# EAGLE design voltage_doubler (EAGLE 7.5.0)
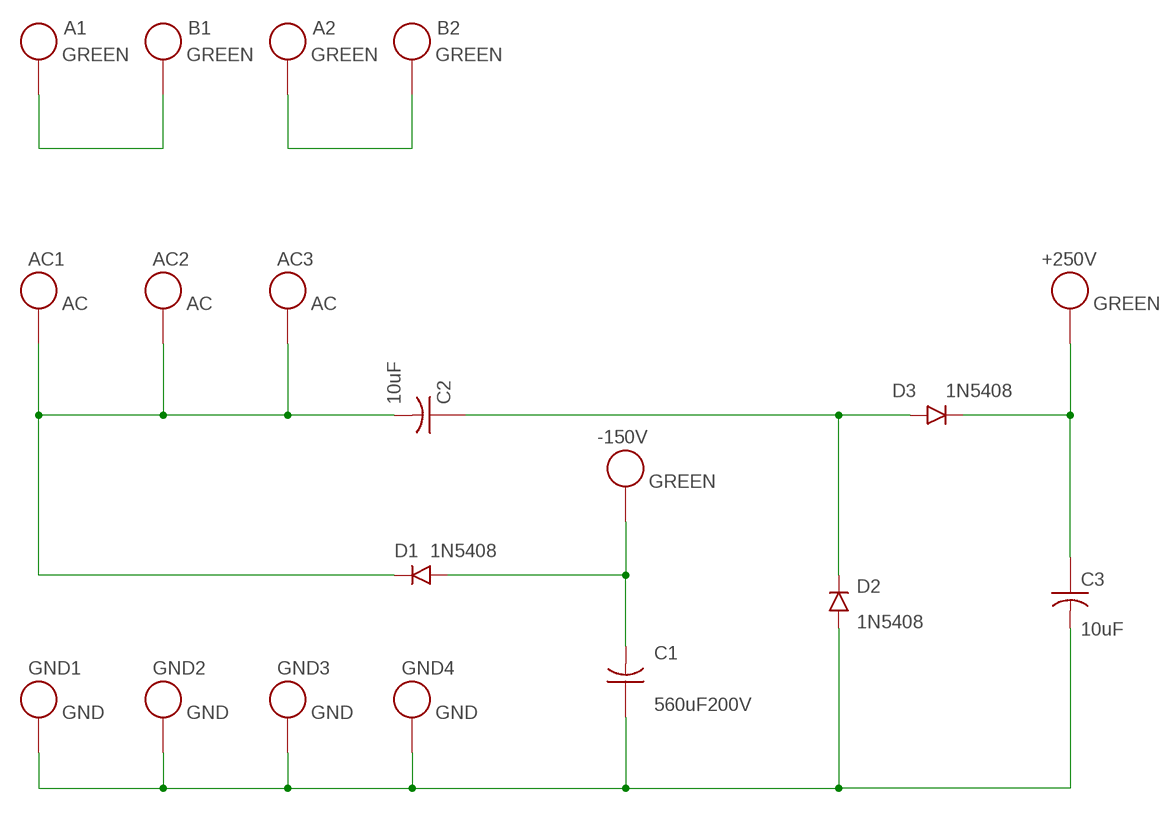
[diagram p0: schematic, sheet 1]

## Parts
+250V  GREEN  BANANA_JACK_GREEN  [AWG22]
-150V  GREEN  BANANA_JACK_GREEN  [AWG22]
A1  GREEN  BANANA_JACK_GREEN  [AWG22]
A2  GREEN  BANANA_JACK_GREEN  [AWG22]
AC1  AC  BANANA_JACK_GREEN  [AWG22]
AC2  AC  BANANA_JACK_GREEN  [AWG22]
AC3  AC  BANANA_JACK_GREEN  [AWG22]
B1  GREEN  BANANA_JACK_GREEN  [AWG22]
B2  GREEN  BANANA_JACK_GREEN  [AWG22]
C1  560uF200V  WIREDCAP  [WIREDCAP]
C2  10uF  CAP400V10UF  [AXIAL10UF400V]
C3  10uF  CAP400V10UF  [AXIAL10UF400V]
D1  1N5408  [DO-201AD]
D2  1N5408  [DO-201AD]
D3  1N5408  [DO-201AD]
GND1  GND  BANANA_JACK_GREEN  [AWG22]
GND2  GND  BANANA_JACK_GREEN  [AWG22]
GND3  GND  BANANA_JACK_GREEN  [AWG22]
GND4  GND  BANANA_JACK_GREEN  [AWG22]

## Nets
N$1: -150V.P$1 C1.P$2 D1.A
N$2: AC1.P$1 AC2.P$1 AC3.P$1 C2.P$2 D1.C
N$3: C1.P$1 C3.P$2 D2.A GND1.P$1 GND2.P$1 GND3.P$1 GND4.P$1
N$4: C2.P$1 D2.C D3.A
N$5: +250V.P$1 C3.P$1 D3.C
N$6: A2.P$1 B2.P$1
N$7: A1.P$1 B1.P$1

## Library data of the parts
+250V -150V A1 A2 B1 B2 = keiths:BANANA_JACK_GREEN: Banana Jack Green, Solder Tab; MPN: 108-0904-001
AC1-AC3 GND1-GND4 = keiths:BANANA_JACK_GREEN: Banana Jack Green, Solder Tab; MPN: 108-0904-001; VALUE: GREEN
C1 = keiths:WIREDCAP: A soldier pad.
C2 C3 = keiths:CAP400V10UF: ALUMINUM ELECTROLYTIC CAPACITOR 400volts 10uF 13x26 20%
D1-D3 = keiths:1N5408: 1N5408 Rectifier Diode 3A 1000V

## Board
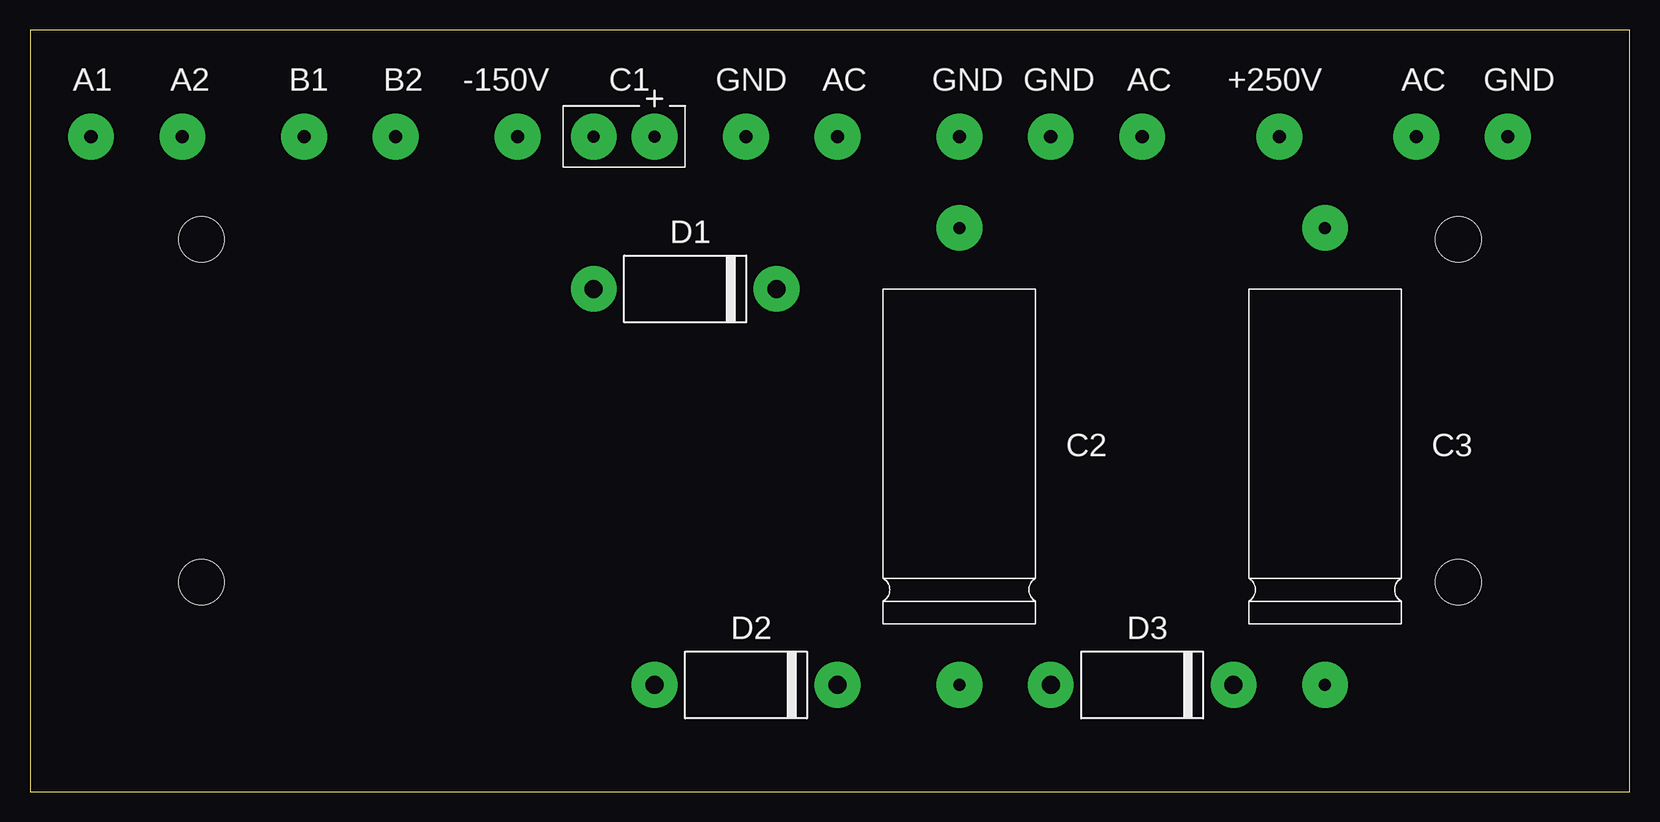
[diagram p1: board, top side]
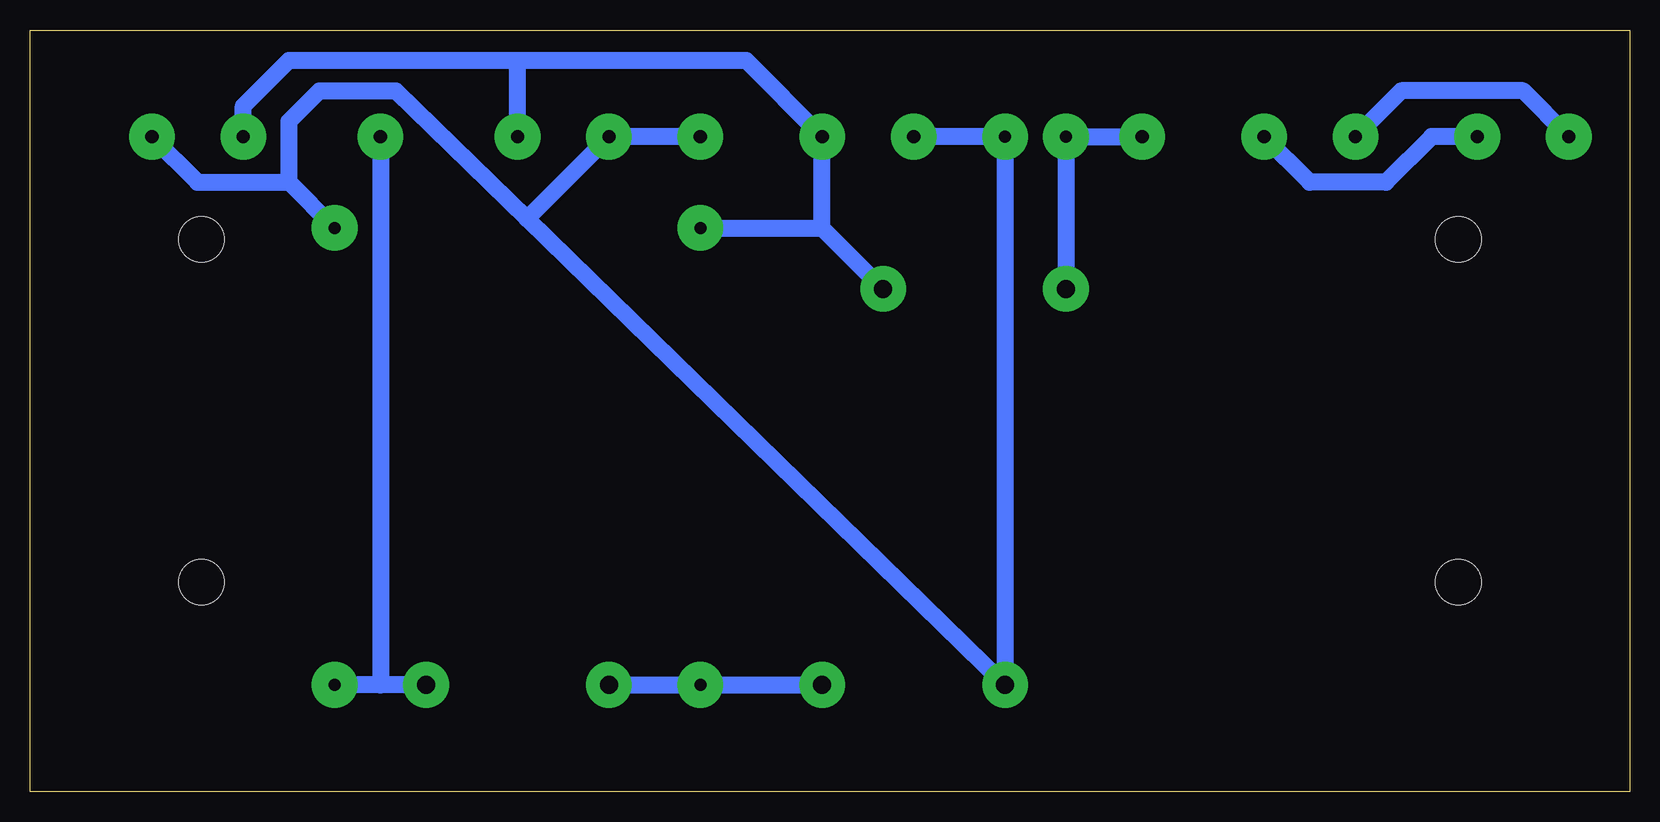
[diagram p2: board, bottom side, seen from below]

Size 133.35 x 63.5 mm. Coordinates in mm from the lower left corner, seen from the top.
Outline: 0,0 133.35,0 133.35,63.5 0,63.5 0,0
Copper layers (1*16): Top 0.035mm / dielectric 1.5mm / Bottom 0.035mm
Design rules "default": minimum track width 10mil, minimum drill 24mil, track to track 8mil, track to pad 8mil, pad to pad 8mil, via to via 8mil, smd to smd 8mil, copper to edge 40mil, drill to drill 8mil, minimum pad ring 10mil, minimum via ring 8mil, stop-mask expansion 4mil, vias tented up to drill 0mil, thermal gap 10mil
Holes 3.8 mm at 14.29,17.46 14.29,46.04 119.06,17.46 119.06,46.04

### Footprints (pad centres in the part's own frame; a part is rotated, then mirrored left to right if it is on the bottom)
AWG22 = drill 1.1 pad 3.81: P$1 0,0
WIREDCAP = drill 1 pad 3.81: P$1 2.54,0; P$2 -2.54,0
AXIAL10UF400V = drill 1 pad 3.81: P$1 19.05,0; P$2 -19.05,0
DO-201AD = drill 1.499 pad 3.81: A 7.62,0; C -7.62,0

### Placement (x,y rotation side)
+250V  104.14,54.61 0 top
-150V  40.64,54.61 0 top
A1  5.08,54.61 90 top
A2  12.7,54.61 90 top
AC1  115.57,54.61 0 top
AC2  92.71,54.61 0 top
AC3  67.31,54.61 0 top
B1  22.86,54.61 90 top
B2  30.48,54.61 90 top
C1  49.53,54.61 0 top
C2  77.47,27.94 270 top
C3  107.95,27.94 270 top
D1  54.61,41.91 180 top
D2  59.69,8.89 180 top
D3  92.71,8.89 180 top
GND1  123.19,54.61 0 top
GND2  85.09,54.61 0 top
GND3  59.69,54.61 0 top
GND4  77.47,54.61 0 top

### Tracks (layer width: path | path; a pad name or v marks a point on that pad's centre or on a via)
N$1
  Bottom 1.422: D1.A C1.P$2 -150V.P$1
N$2
  Bottom 1.422: 92.71,60.96 111.76,60.96 115.57,57.15 AC1.P$1 | 92.71,60.96 73.66,60.96 AC3.P$1 67.31,46.99 | AC2.P$1 92.71,60.96 | C2.P$2 67.31,46.99 | D1.C 67.31,46.99
N$3
  Bottom 1.422: GND1.P$1 119.38,50.8 111.76,50.8 | GND3.P$1 C1.P$1 D2.A 91.93,47.76 | 91.93,47.76 102.87,58.42 109.22,58.42 111.76,55.88 111.76,50.8 | 91.93,47.76 GND2.P$1 GND4.P$1 | C3.P$2 111.76,50.8
N$4
  Bottom 1.422: D3.A C2.P$1 D2.C
N$5
  Bottom 1.422: D3.C 104.14,8.89 | 104.14,8.89 C3.P$1 | +250V.P$1 104.14,8.89
N$6
  Bottom 1.422: B2.P$1 26.67,50.8 20.32,50.8 16.51,54.61 A2.P$1
N$7
  Bottom 1.422: A1.P$1 8.89,58.42 19.05,58.42 B1.P$1